# EAGLE design port_segment (EAGLE 5.11)
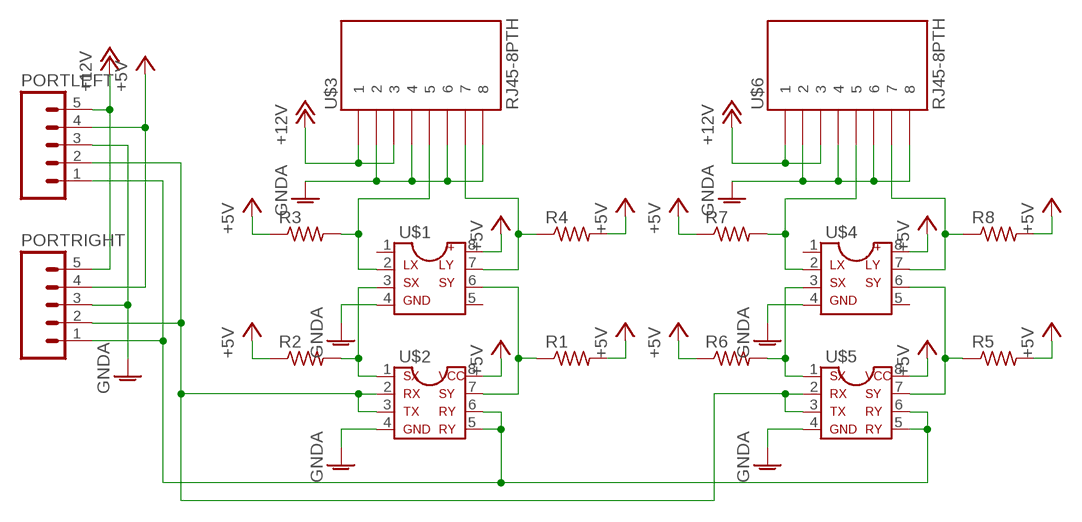
[diagram p0: schematic, sheet 1]

## Parts
PORTLEFT  M05LOCK_LONGPADS  [1X05_LOCK_LONGPADS]
PORTRIGHT  M05LOCK_LONGPADS  [1X05_LOCK_LONGPADS]
R1  R-US_0204/7  [0204/7]
R2  R-US_0204/7  [0204/7]
R3  R-US_0204/7  [0204/7]
R4  R-US_0204/7  [0204/7]
R5  R-US_0204/7  [0204/7]
R6  R-US_0204/7  [0204/7]
R7  R-US_0204/7  [0204/7]
R8  R-US_0204/7  [0204/7]
U$1  P82B715  [DIL08]
U$2  P82B96  [DIL08]
U$3  RJ45-8PTH  [RJ45-8]
U$4  P82B715  [DIL08]
U$5  P82B96  [DIL08]
U$6  RJ45-8PTH  [RJ45-8]

## Nets
+5V: PORTLEFT.4 PORTRIGHT.4 R1.2 R2.1 R3.1 R4.2 R5.2 R6.1 R7.1 R8.2 U$1.8(VCC) U$2.8(VCC) U$4.8(VCC) U$5.8(VCC)
+12V: PORTLEFT.5 PORTRIGHT.5 U$3.1 U$3.3 U$6.1 U$6.3
GNDA: PORTLEFT.3 PORTRIGHT.3 U$1.4(GND) U$2.4(GND) U$3.2 U$3.4 U$3.6 U$3.8 U$4.4(GND) U$5.4(GND) U$6.2 U$6.4 U$6.6 U$6.8
N$4: R3.2 U$1.2(LX) U$3.5
N$5: R4.1 U$1.7(LY) U$3.7
N$6: R1.1 U$1.6(SY) U$2.7(SY)
N$7: R2.2 U$1.3(SX) U$2.1(SX)
N$8: PORTLEFT.1 PORTRIGHT.1 U$2.5(TY) U$2.6(RY) U$5.5(TY) U$5.6(RY)
N$9: PORTLEFT.2 PORTRIGHT.2 U$2.2(RX) U$2.3(TX) U$5.2(RX) U$5.3(TX)
N$10: R7.2 U$4.2(LX) U$6.5
N$11: R8.1 U$4.7(LY) U$6.7
N$12: R5.1 U$4.6(SY) U$5.7(SY)
N$13: R6.2 U$4.3(SX) U$5.1(SX)
Unconnected: U$1.1(NC2) U$1.5(NC1) U$4.1(NC2) U$4.5(NC1)

## Library data of the parts
PORTLEFT PORTRIGHT = SparkFun:M05: Header 5 Standard 5-pin 0.1" header. Use with straight break away headers (SKU : PRT-00116), right angle break away headers (PRT-00553), swiss pins (PRT-00743), machine pins (PRT-00117), and female headers (PRT-00115). Molex polarized connector foot print use with SKU : PRT-08230 with associated crimp pins and housings.
R1-R8 = rcl:R-US_: RESISTOR, American symbol
U$1 U$4 = custom_parts:P82B715
U$2 U$5 = custom_parts:P82B96
U$3 U$6 = SparkFun:RJ45-8: RJ45 Jack Simple RJ45, 8-pin connection - connector for common Cat5, Cat5e, and Cat6 Ethernet cables. Footprint not yet proven in production. Connector sku is PRT-00643; Breakout PCB sku is BOB-00716.

## Board
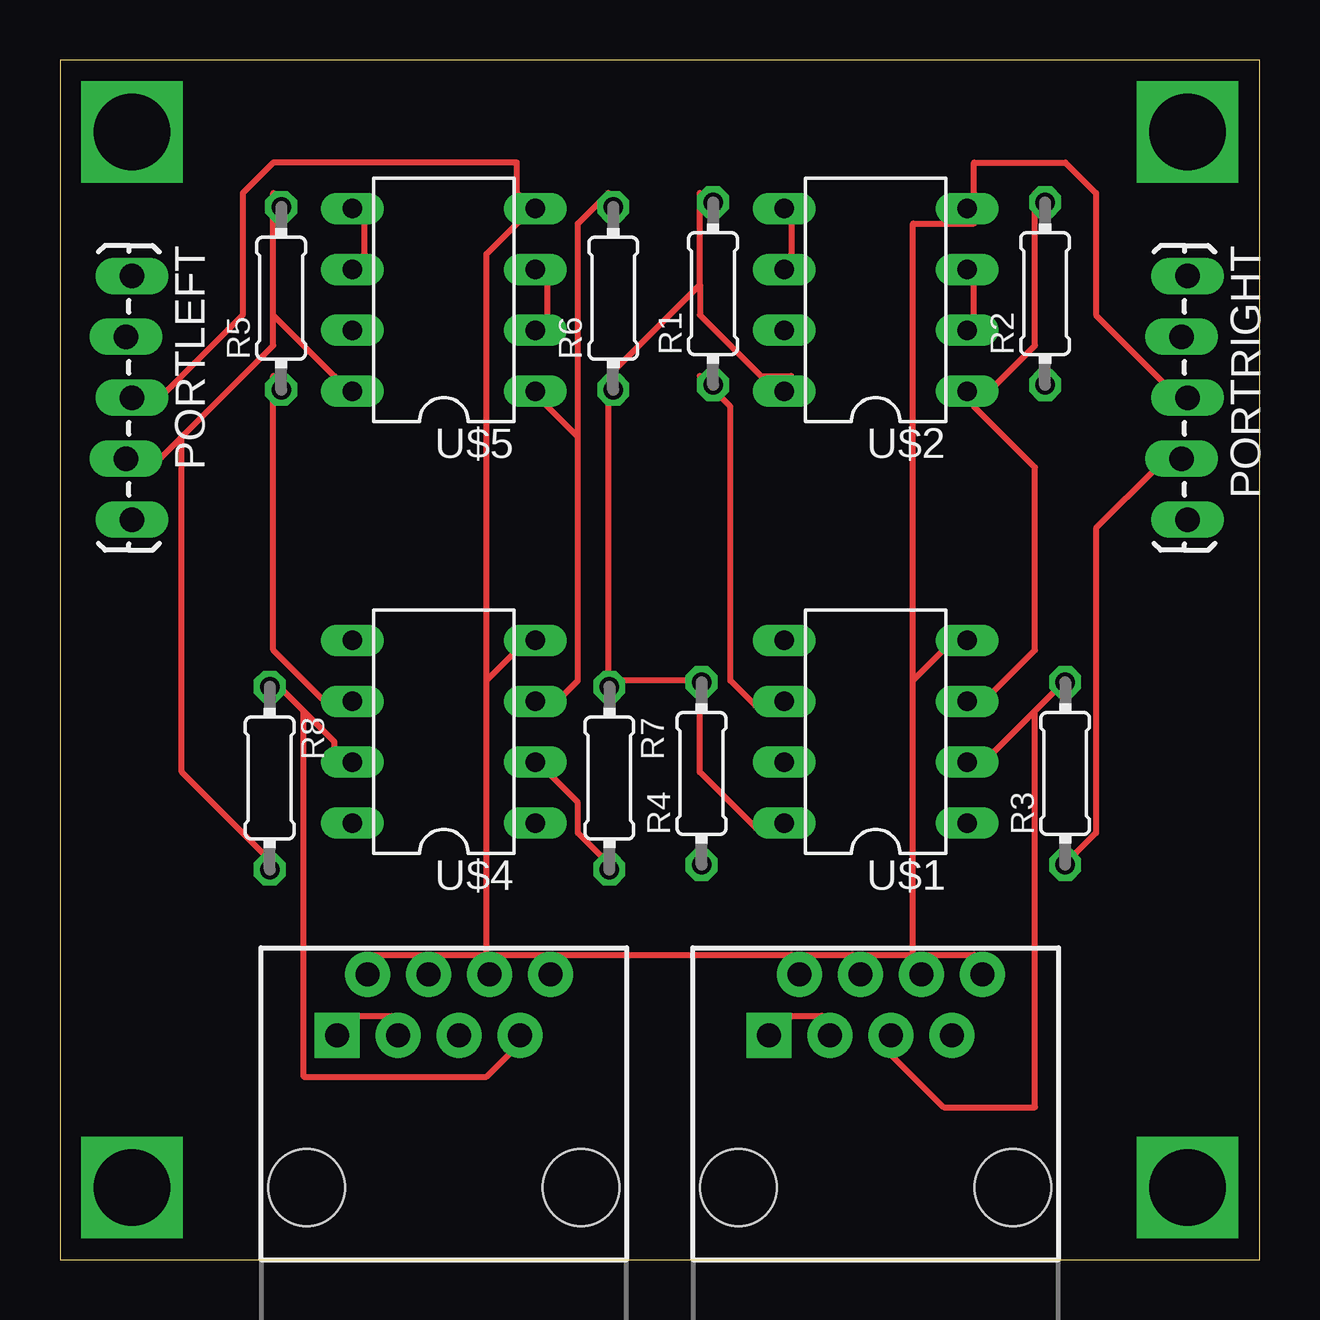
[diagram p1: board, top side]
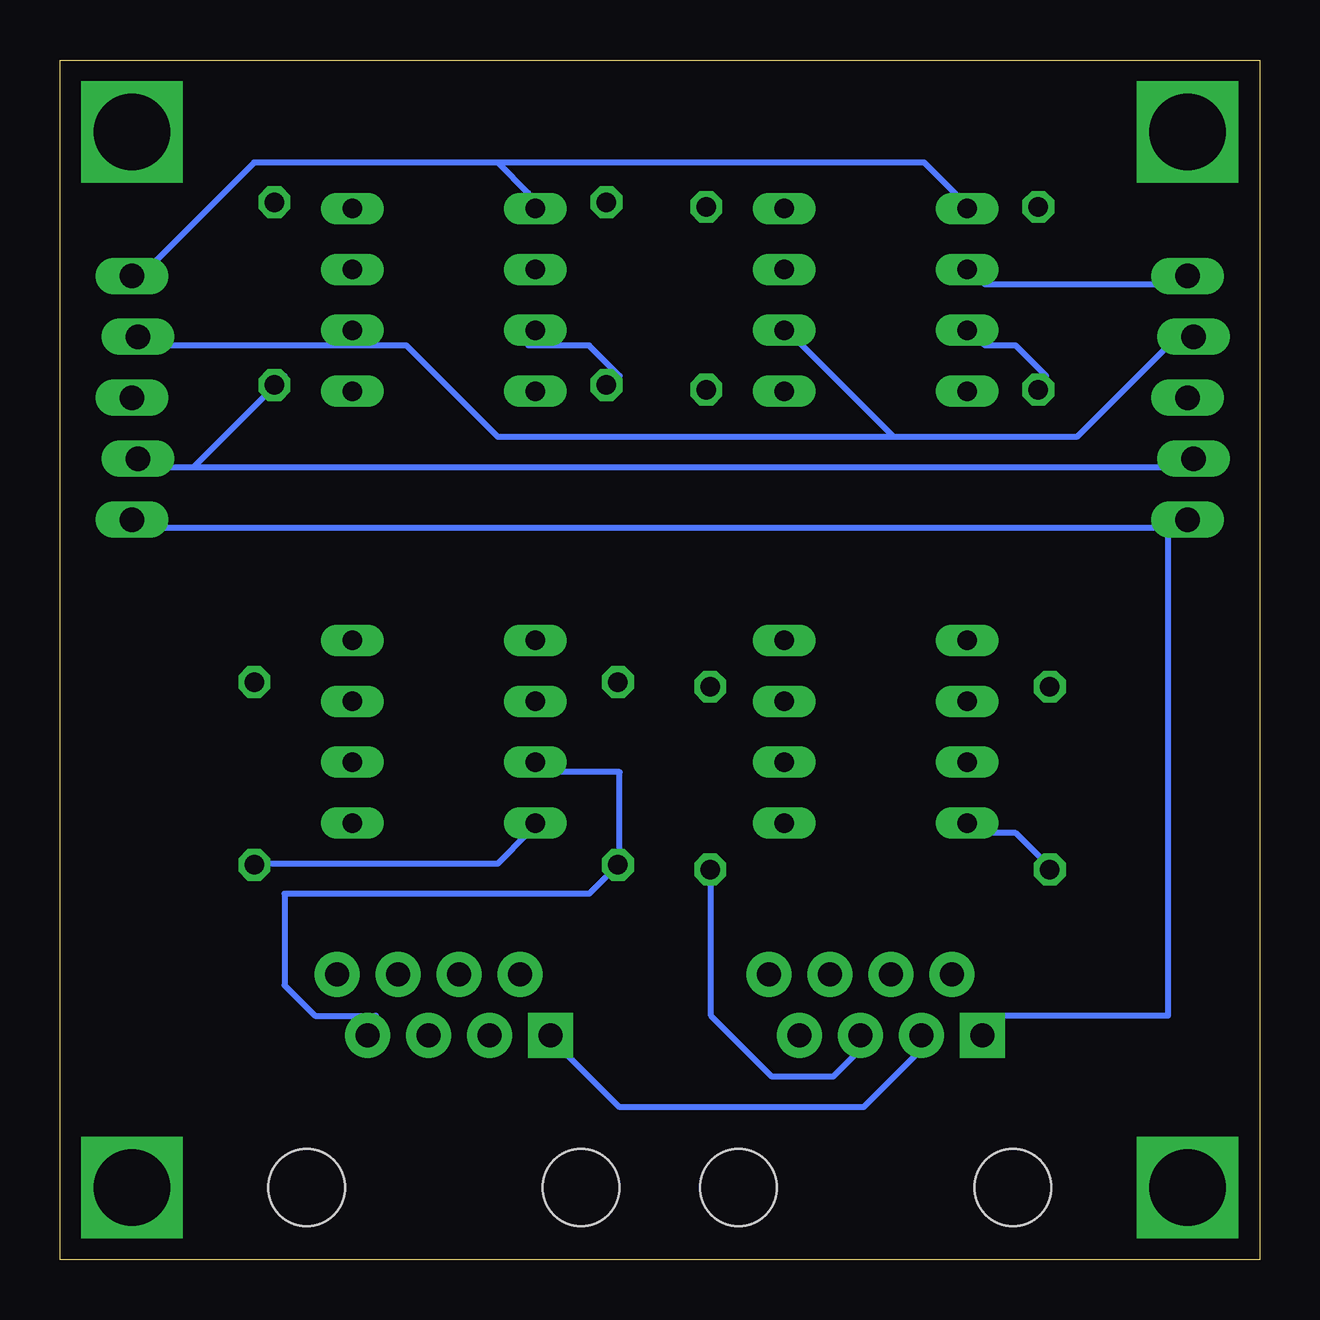
[diagram p2: board, bottom side, seen from below]

Size 50 x 50 mm. Coordinates in mm from the lower left corner, seen from the top.
Outline: 0,0 50,0 50,50 0,50 0,0
Copper layers (1*16): Top 0.035mm / dielectric 1.5mm / Bottom 0.035mm
Design rules "default": minimum track width 10mil, minimum drill 24mil, track to track 8mil, track to pad 8mil, pad to pad 8mil, via to via 8mil, smd to smd 8mil, copper to edge 40mil, drill to drill 8mil, minimum pad ring 10mil, minimum via ring 8mil, stop-mask expansion 4mil, vias tented up to drill 0mil, thermal gap 10mil

### Footprints (pad centres in the part's own frame; a part is rotated, then mirrored left to right if it is on the bottom)
1X05_LOCK_LONGPADS = drill 1.016 long: 1 0,0; 2 2.54,-0.254; 3 5.08,0; 4 7.62,-0.254; 5 10.16,0
0204/7 = drill 0.813 octagon: 1 -3.81,0; 2 3.81,0
DIL08 = drill 0.813 long: 1 -3.81,-3.81; 2 -1.27,-3.81; 3 1.27,-3.81; 4 3.81,-3.81; 5 3.81,3.81; 6 1.27,3.81; 7 -1.27,3.81; 8 -3.81,3.81
RJ45-8 = drill 1 pad 1.88 square: 1 -4.445,6.35 | drill 1 pad 1.88 round: 2 -3.175,8.89; 3 -1.905,6.35; 4 -0.635,8.89; 5 0.635,6.35; 6 1.905,8.89; 7 3.175,6.35; 8 4.445,8.89 | hole 3.2: -5.715,0; 5.715,0

### Placement (x,y rotation side)
PORTLEFT  3,41 270 top
PORTRIGHT  47,41 270 top
R1  27.22,40.26 90 top
R2  41.06,40.26 90 top
R3  41.9,20.26 90 top
R4  26.74,20.26 90 top
R5  9.22,40.07 90 top
R6  23.06,40.07 90 top
R7  22.9,20.07 270 top
R8  8.74,20.07 270 top
U$1  34,22 90 top
U$2  34,40 90 top
U$3  34,3 0 top
U$4  16,22 90 top
U$5  16,40 90 top
U$6  16,3 0 top

### Tracks (layer width: path | path; a pad name or v marks a point on that pad's centre or on a via)
+5V
  Top 0.254: 8.89,39.37 11.43,36.83 U$5.8 | 8.89,39.37 8.89,44.45 R5.2 | 5.08,34.29 8.89,38.1 8.89,39.37 | 5.08,34.29 3.81,33.02 PORTLEFT.4 | 5.08,34.29 5.08,20.32 8.89,16.51 R8.2 | 22.86,36.83 26.67,40.64 | 26.67,40.64 26.67,44.45 R1.2 | 26.67,40.64 26.67,39.37 29.21,36.83 30.48,36.83 U$2.8 | 26.67,24.13 26.67,20.32 29.21,17.78 U$1.8 | 26.67,24.13 22.86,24.13 | 26.67,24.13 R4.2 | PORTRIGHT.4 45.72,33.02 43.18,30.48 43.18,17.78 41.91,16.51 R3.1 | 22.86,24.13 22.86,36.83 | 22.86,36.83 R6.1 | 22.86,24.13 R7.1
  Bottom 0.254: R8.2 8.89,16.51 10.16,17.78 11.43,17.78 U$4.8 | 44.45,33.02 40.64,36.83 R2.1 | 44.45,33.02 45.72,33.02 PORTRIGHT.4 | R3.1 41.91,16.51 31.75,16.51 30.48,17.78 U$1.8 | 44.45,33.02 3.81,33.02 PORTLEFT.4
+12V
  Top 0.254: U$3.1 30.48,10.16 31.75,10.16 U$3.3 | U$6.3 13.97,10.16 11.43,10.16 U$6.1
  Bottom 0.254: 3.81,30.48 3.81,10.16 11.43,10.16 U$6.1 | 3.81,30.48 46.99,30.48 PORTRIGHT.5 | 3.81,30.48 PORTLEFT.5 | U$3.1 29.21,8.89 26.67,6.35 16.51,6.35 13.97,8.89 U$6.3
GNDA
  Top 0.254: 30.48,12.7 33.02,12.7 | 35.56,24.13 36.83,25.4 U$1.4 | 35.56,12.7 35.56,24.13 | 35.56,24.13 35.56,43.18 38.1,43.18 U$2.4 38.1,44.45 38.1,45.72 41.91,45.72 43.18,44.45 43.18,39.37 46.99,35.56 PORTRIGHT.3 | 35.56,12.7 38.1,12.7 U$3.8 | 33.02,12.7 35.56,12.7 | 33.02,12.7 U$3.4 | 35.56,12.7 U$3.6 | 15.24,12.7 12.7,12.7 U$6.2 | 17.78,24.13 19.05,25.4 U$4.4 | 17.78,12.7 17.78,24.13 | 17.78,24.13 17.78,41.91 19.05,43.18 U$5.4 19.05,44.45 19.05,45.72 8.89,45.72 7.62,44.45 7.62,39.37 3.81,35.56 PORTLEFT.3 | 17.78,12.7 20.32,12.7 | 15.24,12.7 17.78,12.7 | 15.24,12.7 U$6.4 | 17.78,12.7 U$6.6 | 20.32,12.7 30.48,12.7 | 30.48,12.7 U$3.2 | 20.32,12.7 U$6.8
N$1  (via drill 3.2)
  other vias: 3,3
N$2  (via drill 3.2)
  other vias: 47,3
N$3  (via drill 3.2)
  other vias: 47,47
N$4
  Top 0.254: 40.64,22.86 41.91,24.13 R3.2 | 40.64,22.86 38.1,20.32 U$1.2 | 40.64,22.86 40.64,6.35 36.83,6.35 34.29,8.89 U$3.5
N$5
  Bottom 0.254: 26.67,16.51 26.67,20.32 29.21,20.32 U$1.7 | 26.67,16.51 27.94,15.24 40.64,15.24 40.64,11.43 39.37,10.16 36.83,10.16 U$3.7 | R4.1 26.67,16.51
N$6
  Top 0.254: U$1.6 29.21,22.86 27.94,24.13 27.94,35.56 26.67,36.83 R1.1
  Bottom 0.254: R1.1 26.67,36.83 27.94,38.1 30.48,38.1 U$2.7
N$7
  Top 0.254: 38.1,35.56 40.64,33.02 40.64,25.4 38.1,22.86 U$1.3 | 38.1,35.56 40.64,38.1 40.64,44.45 R2.2 | 38.1,35.56 U$2.1
N$8
  Top 0.254: U$5.6 12.7,41.91 12.7,43.18 U$5.5 | U$2.6 30.48,41.91 30.48,43.18 U$2.5
  Bottom 0.254: PORTLEFT.1 3.81,40.64 11.43,40.64 U$5.6 | 31.75,45.72 41.91,45.72 46.99,40.64 PORTRIGHT.1 | 31.75,45.72 30.48,44.45 U$2.5 | 31.75,45.72 13.97,45.72 12.7,44.45 U$5.5
N$9
  Top 0.254: U$2.2 38.1,39.37 38.1,40.64 U$2.3 | U$5.2 20.32,39.37 20.32,40.64 U$5.3
  Bottom 0.254: 38.1,38.1 45.72,38.1 PORTRIGHT.2 | 15.24,34.29 7.62,34.29 3.81,38.1 PORTLEFT.2 | 15.24,34.29 19.05,38.1 U$5.2 | 38.1,38.1 35.56,38.1 31.75,34.29 15.24,34.29 | 38.1,38.1 U$2.2
N$10
  Top 0.254: R7.2 22.86,16.51 21.59,17.78 21.59,19.05 20.32,20.32 U$4.2
  Bottom 0.254: U$6.5 16.51,8.89 17.78,7.62 20.32,7.62 22.86,10.16 22.86,16.51 R7.2
N$11
  Top 0.254: 10.16,22.86 11.43,21.59 11.43,20.32 U$4.7 | 10.16,22.86 8.89,24.13 R8.1 | 10.16,22.86 10.16,7.62 17.78,7.62 19.05,8.89 U$6.7
N$12
  Top 0.254: U$4.6 11.43,22.86 8.89,25.4 8.89,36.83 R5.1
  Bottom 0.254: R5.1 8.89,36.83 10.16,38.1 11.43,38.1 U$5.7
N$13
  Top 0.254: 21.59,34.29 21.59,24.13 20.32,22.86 U$4.3 | 21.59,34.29 20.32,35.56 U$5.1 | 21.59,34.29 21.59,43.18 22.86,44.45 R6.2
N$14  (via drill 3.2)
  other vias: 3,47